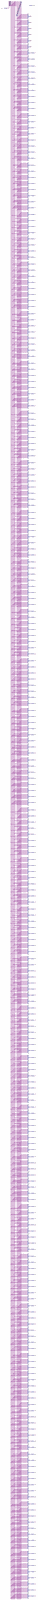
[diagram p0: schematic sheet, whole]
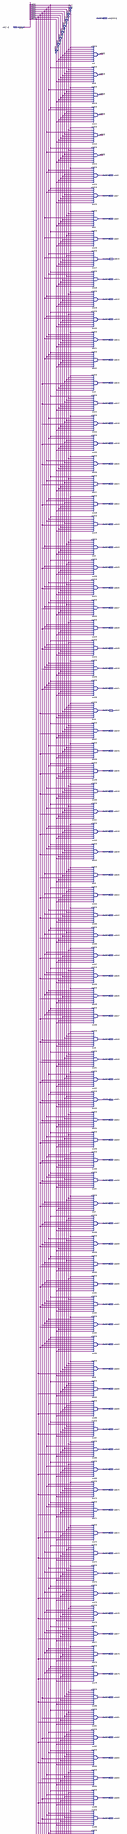
[diagram p1: schematic sheet, upper part]
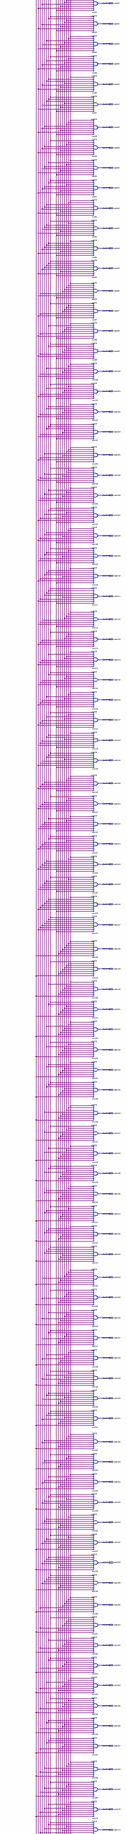
[diagram p2: schematic sheet, middle part]
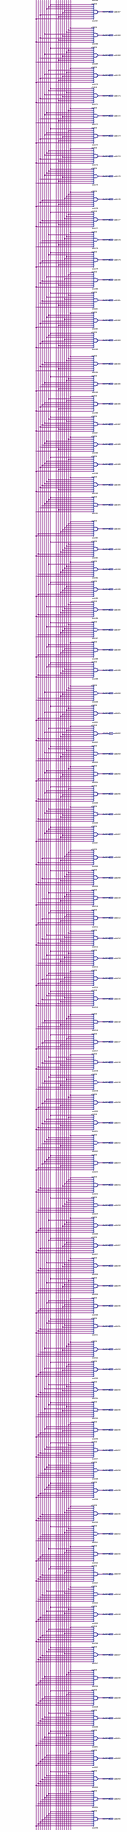
[diagram p3: schematic sheet, lower part]
// Quartus schematic ymq_8.bdf as structural Verilog: 264 symbols, 252 pins
module ymq_8 (
  input  [7:0] adr,
  output [255:0] addr,
  output addr6,
  output addr7,
  output addr8,
  output addr9,
  output addr10,
  output addr11,
  output addr12,
  output addr13,
  output addr14,
  output addr15,
  output addr16,
  output addr17,
  output addr18,
  output addr19,
  output addr20,
  output addr21,
  output addr22,
  output addr23,
  output addr24,
  output addr25,
  output addr26,
  output addr27,
  output addr28,
  output addr29,
  output addr30,
  output addr31,
  output addr32,
  output addr33,
  output addr34,
  output addr35,
  output addr36,
  output addr37,
  output addr38,
  output addr39,
  output addr40,
  output addr41,
  output addr42,
  output addr43,
  output addr44,
  output addr45,
  output addr46,
  output addr47,
  output addr48,
  output addr49,
  output addr50,
  output addr51,
  output addr52,
  output addr53,
  output addr54,
  output addr55,
  output addr56,
  output addr57,
  output addr58,
  output addr59,
  output addr60,
  output addr61,
  output addr62,
  output addr63,
  output addr64,
  output addr65,
  output addr66,
  output addr67,
  output addr68,
  output addr69,
  output addr70,
  output addr71,
  output addr72,
  output addr73,
  output addr74,
  output addr75,
  output addr76,
  output addr77,
  output addr78,
  output addr79,
  output addr80,
  output addr81,
  output addr82,
  output addr83,
  output addr84,
  output addr85,
  output addr86,
  output addr87,
  output addr88,
  output addr89,
  output addr90,
  output addr91,
  output addr92,
  output addr93,
  output addr94,
  output addr95,
  output addr96,
  output addr97,
  output addr98,
  output addr99,
  output addr100,
  output addr101,
  output addr102,
  output addr103,
  output addr104,
  output addr105,
  output addr106,
  output addr107,
  output addr108,
  output addr109,
  output addr110,
  output addr111,
  output addr112,
  output addr113,
  output addr114,
  output addr115,
  output addr116,
  output addr117,
  output addr118,
  output addr119,
  output addr120,
  output addr121,
  output addr122,
  output addr123,
  output addr124,
  output addr125,
  output addr126,
  output addr127,
  output addr128,
  output addr129,
  output addr130,
  output addr131,
  output addr132,
  output addr133,
  output addr134,
  output addr135,
  output addr136,
  output addr137,
  output addr138,
  output addr139,
  output addr140,
  output addr141,
  output addr142,
  output addr143,
  output addr144,
  output addr145,
  output addr146,
  output addr147,
  output addr148,
  output addr149,
  output addr150,
  output addr151,
  output addr152,
  output addr153,
  output addr154,
  output addr155,
  output addr156,
  output addr157,
  output addr158,
  output addr159,
  output addr160,
  output addr161,
  output addr162,
  output addr163,
  output addr164,
  output addr165,
  output addr166,
  output addr167,
  output addr168,
  output addr169,
  output addr170,
  output addr171,
  output addr172,
  output addr173,
  output addr174,
  output addr175,
  output addr176,
  output addr177,
  output addr178,
  output addr179,
  output addr180,
  output addr181,
  output addr182,
  output addr183,
  output addr184,
  output addr185,
  output addr186,
  output addr187,
  output addr188,
  output addr189,
  output addr190,
  output addr191,
  output addr192,
  output addr193,
  output addr194,
  output addr195,
  output addr196,
  output addr197,
  output addr198,
  output addr199,
  output addr200,
  output addr201,
  output addr202,
  output addr203,
  output addr204,
  output addr205,
  output addr206,
  output addr207,
  output addr208,
  output addr209,
  output addr210,
  output addr211,
  output addr212,
  output addr213,
  output addr214,
  output addr215,
  output addr216,
  output addr217,
  output addr218,
  output addr219,
  output addr220,
  output addr221,
  output addr222,
  output addr223,
  output addr224,
  output addr225,
  output addr226,
  output addr227,
  output addr228,
  output addr229,
  output addr230,
  output addr231,
  output addr232,
  output addr233,
  output addr234,
  output addr235,
  output addr236,
  output addr237,
  output addr238,
  output addr239,
  output addr240,
  output addr241,
  output addr242,
  output addr243,
  output addr244,
  output addr245,
  output addr246,
  output addr247,
  output addr248,
  output addr249,
  output addr250,
  output addr251,
  output addr252,
  output addr253,
  output addr254,
  output addr255
);

  wire inst1408_out, inst1409_out, inst1410_out, inst1411_out, inst1412_out, inst1413_out, inst1414_out,
       inst1415_out;

  not inst1410 (inst1410_out, adr[5]);
  not inst1409 (inst1409_out, adr[6]);
  not inst1408 (inst1408_out, adr[7]);
  not inst1414 (inst1414_out, adr[1]);
  not inst1413 (inst1413_out, adr[2]);
  not inst1412 (inst1412_out, adr[3]);
  not inst1411 (inst1411_out, adr[4]);
  not inst1415 (inst1415_out, adr[0]);
  and inst (addr[0], inst1415_out, inst1414_out, inst1413_out, inst1412_out, inst1411_out, inst1410_out, inst1409_out, inst1408_out);
  and inst9 (addr[1], adr[0], inst1414_out, inst1413_out, inst1412_out, inst1411_out, inst1410_out, inst1409_out, inst1408_out);
  and inst10 (addr[2], inst1415_out, adr[1], inst1413_out, inst1412_out, inst1411_out, inst1410_out, inst1409_out, inst1408_out);
  and inst11 (addr[3], adr[0], adr[1], inst1413_out, inst1412_out, inst1411_out, inst1410_out, inst1409_out, inst1408_out);
  and inst12 (addr[4], inst1415_out, inst1414_out, adr[2], inst1412_out, inst1411_out, inst1410_out, inst1409_out, inst1408_out);
  and inst13 (addr[5], adr[0], inst1414_out, adr[2], inst1412_out, inst1411_out, inst1410_out, inst1409_out, inst1408_out);
  and inst14 (addr[6], inst1415_out, adr[1], adr[2], inst1412_out, inst1411_out, inst1410_out, inst1409_out, inst1408_out);
  and inst15 (addr[7], adr[0], adr[1], adr[2], inst1412_out, inst1411_out, inst1410_out, inst1409_out, inst1408_out);
  and inst1 (addr[8], inst1415_out, inst1414_out, inst1413_out, adr[3], inst1411_out, inst1410_out, inst1409_out, inst1408_out);
  and inst16 (addr[9], adr[0], inst1414_out, inst1413_out, adr[3], inst1411_out, inst1410_out, inst1409_out, inst1408_out);
  and inst17 (addr[10], inst1415_out, adr[1], inst1413_out, adr[3], inst1411_out, inst1410_out, inst1409_out, inst1408_out);
  and inst18 (addr[11], adr[0], adr[1], inst1413_out, adr[3], inst1411_out, inst1410_out, inst1409_out, inst1408_out);
  and inst19 (addr[12], inst1415_out, inst1414_out, adr[2], adr[3], inst1411_out, inst1410_out, inst1409_out, inst1408_out);
  and inst20 (addr[13], adr[0], inst1414_out, adr[2], adr[3], inst1411_out, inst1410_out, inst1409_out, inst1408_out);
  and inst21 (addr[14], inst1415_out, adr[1], adr[2], adr[3], inst1411_out, inst1410_out, inst1409_out, inst1408_out);
  and inst22 (addr[15], adr[0], adr[1], adr[2], adr[3], inst1411_out, inst1410_out, inst1409_out, inst1408_out);
  and inst2 (addr[16], inst1415_out, inst1414_out, inst1413_out, inst1412_out, adr[4], inst1410_out, inst1409_out, inst1408_out);
  and inst23 (addr[17], adr[0], inst1414_out, inst1413_out, inst1412_out, adr[4], inst1410_out, inst1409_out, inst1408_out);
  and inst24 (addr[18], inst1415_out, adr[1], inst1413_out, inst1412_out, adr[4], inst1410_out, inst1409_out, inst1408_out);
  and inst25 (addr[19], adr[0], adr[1], inst1413_out, inst1412_out, adr[4], inst1410_out, inst1409_out, inst1408_out);
  and inst26 (addr[20], inst1415_out, inst1414_out, adr[2], inst1412_out, adr[4], inst1410_out, inst1409_out, inst1408_out);
  and inst27 (addr[21], adr[0], inst1414_out, adr[2], inst1412_out, adr[4], inst1410_out, inst1409_out, inst1408_out);
  and inst28 (addr[22], inst1415_out, adr[1], adr[2], inst1412_out, adr[4], inst1410_out, inst1409_out, inst1408_out);
  and inst29 (addr[23], adr[0], adr[1], adr[2], inst1412_out, adr[4], inst1410_out, inst1409_out, inst1408_out);
  and inst3 (addr[24], inst1415_out, inst1414_out, inst1413_out, adr[3], adr[4], inst1410_out, inst1409_out, inst1408_out);
  and inst30 (addr[25], adr[0], inst1414_out, inst1413_out, adr[3], adr[4], inst1410_out, inst1409_out, inst1408_out);
  and inst31 (addr[26], inst1415_out, adr[1], inst1413_out, adr[3], adr[4], inst1410_out, inst1409_out, inst1408_out);
  and inst32 (addr[27], adr[0], adr[1], inst1413_out, adr[3], adr[4], inst1410_out, inst1409_out, inst1408_out);
  and inst33 (addr[28], inst1415_out, inst1414_out, adr[2], adr[3], adr[4], inst1410_out, inst1409_out, inst1408_out);
  and inst34 (addr[29], adr[0], inst1414_out, adr[2], adr[3], adr[4], inst1410_out, inst1409_out, inst1408_out);
  and inst35 (addr[30], inst1415_out, adr[1], adr[2], adr[3], adr[4], inst1410_out, inst1409_out, inst1408_out);
  and inst36 (addr[31], adr[0], adr[1], adr[2], adr[3], adr[4], inst1410_out, inst1409_out, inst1408_out);
  and inst4 (addr[32], inst1415_out, inst1414_out, inst1413_out, inst1412_out, inst1411_out, adr[5], inst1409_out, inst1408_out);
  and inst37 (addr[33], adr[0], inst1414_out, inst1413_out, inst1412_out, inst1411_out, adr[5], inst1409_out, inst1408_out);
  and inst38 (addr[34], inst1415_out, adr[1], inst1413_out, inst1412_out, inst1411_out, adr[5], inst1409_out, inst1408_out);
  and inst39 (addr[35], adr[0], adr[1], inst1413_out, inst1412_out, inst1411_out, adr[5], inst1409_out, inst1408_out);
  and inst40 (addr[36], inst1415_out, inst1414_out, adr[2], inst1412_out, inst1411_out, adr[5], inst1409_out, inst1408_out);
  and inst41 (addr[37], adr[0], inst1414_out, adr[2], inst1412_out, inst1411_out, adr[5], inst1409_out, inst1408_out);
  and inst42 (addr[38], inst1415_out, adr[1], adr[2], inst1412_out, inst1411_out, adr[5], inst1409_out, inst1408_out);
  and inst43 (addr[39], adr[0], adr[1], adr[2], inst1412_out, inst1411_out, adr[5], inst1409_out, inst1408_out);
  and inst5 (addr[40], inst1415_out, inst1414_out, inst1413_out, adr[3], inst1411_out, adr[5], inst1409_out, inst1408_out);
  and inst44 (addr[41], adr[0], inst1414_out, inst1413_out, adr[3], inst1411_out, adr[5], inst1409_out, inst1408_out);
  and inst45 (addr[42], inst1415_out, adr[1], inst1413_out, adr[3], inst1411_out, adr[5], inst1409_out, inst1408_out);
  and inst46 (addr[43], adr[0], adr[1], inst1413_out, adr[3], inst1411_out, adr[5], inst1409_out, inst1408_out);
  and inst47 (addr[44], inst1415_out, inst1414_out, adr[2], adr[3], inst1411_out, adr[5], inst1409_out, inst1408_out);
  and inst48 (addr[45], adr[0], inst1414_out, adr[2], adr[3], inst1411_out, adr[5], inst1409_out, inst1408_out);
  and inst49 (addr[46], inst1415_out, adr[1], adr[2], adr[3], inst1411_out, adr[5], inst1409_out, inst1408_out);
  and inst50 (addr[47], adr[0], adr[1], adr[2], adr[3], inst1411_out, adr[5], inst1409_out, inst1408_out);
  and inst6 (addr[48], inst1415_out, inst1414_out, inst1413_out, inst1412_out, adr[4], adr[5], inst1409_out, inst1408_out);
  and inst51 (addr[49], adr[0], inst1414_out, inst1413_out, inst1412_out, adr[4], adr[5], inst1409_out, inst1408_out);
  and inst52 (addr[50], inst1415_out, adr[1], inst1413_out, inst1412_out, adr[4], adr[5], inst1409_out, inst1408_out);
  and inst53 (addr[51], adr[0], adr[1], inst1413_out, inst1412_out, adr[4], adr[5], inst1409_out, inst1408_out);
  and inst54 (addr[52], inst1415_out, inst1414_out, adr[2], inst1412_out, adr[4], adr[5], inst1409_out, inst1408_out);
  and inst55 (addr[53], adr[0], inst1414_out, adr[2], inst1412_out, adr[4], adr[5], inst1409_out, inst1408_out);
  and inst56 (addr[54], inst1415_out, adr[1], adr[2], inst1412_out, adr[4], adr[5], inst1409_out, inst1408_out);
  and inst57 (addr[55], adr[0], adr[1], adr[2], inst1412_out, adr[4], adr[5], inst1409_out, inst1408_out);
  and inst7 (addr[56], inst1415_out, inst1414_out, inst1413_out, adr[3], adr[4], adr[5], inst1409_out, inst1408_out);
  and inst58 (addr[57], adr[0], inst1414_out, inst1413_out, adr[3], adr[4], adr[5], inst1409_out, inst1408_out);
  and inst59 (addr[58], inst1415_out, adr[1], inst1413_out, adr[3], adr[4], adr[5], inst1409_out, inst1408_out);
  and inst60 (addr[59], adr[0], adr[1], inst1413_out, adr[3], adr[4], adr[5], inst1409_out, inst1408_out);
  and inst61 (addr[60], inst1415_out, inst1414_out, adr[2], adr[3], adr[4], adr[5], inst1409_out, inst1408_out);
  and inst62 (addr[61], adr[0], inst1414_out, adr[2], adr[3], adr[4], adr[5], inst1409_out, inst1408_out);
  and inst63 (addr[62], inst1415_out, adr[1], adr[2], adr[3], adr[4], adr[5], inst1409_out, inst1408_out);
  and inst64 (addr[63], adr[0], adr[1], adr[2], adr[3], adr[4], adr[5], inst1409_out, inst1408_out);
  and inst8 (addr[64], inst1415_out, inst1414_out, inst1413_out, inst1412_out, inst1411_out, inst1410_out, adr[6], inst1408_out);
  and inst65 (addr[65], adr[0], inst1414_out, inst1413_out, inst1412_out, inst1411_out, inst1410_out, adr[6], inst1408_out);
  and inst66 (addr[66], inst1415_out, adr[1], inst1413_out, inst1412_out, inst1411_out, inst1410_out, adr[6], inst1408_out);
  and inst67 (addr[67], adr[0], adr[1], inst1413_out, inst1412_out, inst1411_out, inst1410_out, adr[6], inst1408_out);
  and inst68 (addr[68], inst1415_out, inst1414_out, adr[2], inst1412_out, inst1411_out, inst1410_out, adr[6], inst1408_out);
  and inst69 (addr[69], adr[0], inst1414_out, adr[2], inst1412_out, inst1411_out, inst1410_out, adr[6], inst1408_out);
  and inst70 (addr[70], inst1415_out, adr[1], adr[2], inst1412_out, inst1411_out, inst1410_out, adr[6], inst1408_out);
  and inst71 (addr[71], adr[0], adr[1], adr[2], inst1412_out, inst1411_out, inst1410_out, adr[6], inst1408_out);
  and inst72 (addr[72], inst1415_out, inst1414_out, inst1413_out, adr[3], inst1411_out, inst1410_out, adr[6], inst1408_out);
  and inst73 (addr[73], adr[0], inst1414_out, inst1413_out, adr[3], inst1411_out, inst1410_out, adr[6], inst1408_out);
  and inst74 (addr[74], inst1415_out, adr[1], inst1413_out, adr[3], inst1411_out, inst1410_out, adr[6], inst1408_out);
  and inst75 (addr[75], adr[0], adr[1], inst1413_out, adr[3], inst1411_out, inst1410_out, adr[6], inst1408_out);
  and inst76 (addr[76], inst1415_out, inst1414_out, adr[2], adr[3], inst1411_out, inst1410_out, adr[6], inst1408_out);
  and inst77 (addr[77], adr[0], inst1414_out, adr[2], adr[3], inst1411_out, inst1410_out, adr[6], inst1408_out);
  and inst78 (addr[78], inst1415_out, adr[1], adr[2], adr[3], inst1411_out, inst1410_out, adr[6], inst1408_out);
  and inst79 (addr[79], adr[0], adr[1], adr[2], adr[3], inst1411_out, inst1410_out, adr[6], inst1408_out);
  and inst80 (addr[80], inst1415_out, inst1414_out, inst1413_out, inst1412_out, adr[4], inst1410_out, adr[6], inst1408_out);
  and inst81 (addr[81], adr[0], inst1414_out, inst1413_out, inst1412_out, adr[4], inst1410_out, adr[6], inst1408_out);
  and inst82 (addr[82], inst1415_out, adr[1], inst1413_out, inst1412_out, adr[4], inst1410_out, adr[6], inst1408_out);
  and inst83 (addr[83], adr[0], adr[1], inst1413_out, inst1412_out, adr[4], inst1410_out, adr[6], inst1408_out);
  and inst84 (addr[84], inst1415_out, inst1414_out, adr[2], inst1412_out, adr[4], inst1410_out, adr[6], inst1408_out);
  and inst85 (addr[85], adr[0], inst1414_out, adr[2], inst1412_out, adr[4], inst1410_out, adr[6], inst1408_out);
  and inst86 (addr[86], inst1415_out, adr[1], adr[2], inst1412_out, adr[4], inst1410_out, adr[6], inst1408_out);
  and inst87 (addr[87], adr[0], adr[1], adr[2], inst1412_out, adr[4], inst1410_out, adr[6], inst1408_out);
  and inst88 (addr[88], inst1415_out, inst1414_out, inst1413_out, adr[3], adr[4], inst1410_out, adr[6], inst1408_out);
  and inst89 (addr[89], adr[0], inst1414_out, inst1413_out, adr[3], adr[4], inst1410_out, adr[6], inst1408_out);
  and inst90 (addr[90], inst1415_out, adr[1], inst1413_out, adr[3], adr[4], inst1410_out, adr[6], inst1408_out);
  and inst91 (addr[91], adr[0], adr[1], inst1413_out, adr[3], adr[4], inst1410_out, adr[6], inst1408_out);
  and inst92 (addr[92], inst1415_out, inst1414_out, adr[2], adr[3], adr[4], inst1410_out, adr[6], inst1408_out);
  and inst93 (addr[93], adr[0], inst1414_out, adr[2], adr[3], adr[4], inst1410_out, adr[6], inst1408_out);
  and inst94 (addr[94], inst1415_out, adr[1], adr[2], adr[3], adr[4], inst1410_out, adr[6], inst1408_out);
  and inst95 (addr[95], adr[0], adr[1], adr[2], adr[3], adr[4], inst1410_out, adr[6], inst1408_out);
  and inst96 (addr[96], inst1415_out, inst1414_out, inst1413_out, inst1412_out, inst1411_out, adr[5], adr[6], inst1408_out);
  and inst97 (addr[97], adr[0], inst1414_out, inst1413_out, inst1412_out, inst1411_out, adr[5], adr[6], inst1408_out);
  and inst98 (addr[98], inst1415_out, adr[1], inst1413_out, inst1412_out, inst1411_out, adr[5], adr[6], inst1408_out);
  and inst99 (addr[99], adr[0], adr[1], inst1413_out, inst1412_out, inst1411_out, adr[5], adr[6], inst1408_out);
  and inst100 (addr[100], inst1415_out, inst1414_out, adr[2], inst1412_out, inst1411_out, adr[5], adr[6], inst1408_out);
  and inst101 (addr[101], adr[0], inst1414_out, adr[2], inst1412_out, inst1411_out, adr[5], adr[6], inst1408_out);
  and inst102 (addr[102], inst1415_out, adr[1], adr[2], inst1412_out, inst1411_out, adr[5], adr[6], inst1408_out);
  and inst103 (addr[103], adr[0], adr[1], adr[2], inst1412_out, inst1411_out, adr[5], adr[6], inst1408_out);
  and inst104 (addr[104], inst1415_out, inst1414_out, inst1413_out, adr[3], inst1411_out, adr[5], adr[6], inst1408_out);
  and inst105 (addr[105], adr[0], inst1414_out, inst1413_out, adr[3], inst1411_out, adr[5], adr[6], inst1408_out);
  and inst106 (addr[106], inst1415_out, adr[1], inst1413_out, adr[3], inst1411_out, adr[5], adr[6], inst1408_out);
  and inst107 (addr[107], adr[0], adr[1], inst1413_out, adr[3], inst1411_out, adr[5], adr[6], inst1408_out);
  and inst108 (addr[108], inst1415_out, inst1414_out, adr[2], adr[3], inst1411_out, adr[5], adr[6], inst1408_out);
  and inst109 (addr[109], adr[0], inst1414_out, adr[2], adr[3], inst1411_out, adr[5], adr[6], inst1408_out);
  and inst110 (addr[110], inst1415_out, adr[1], adr[2], adr[3], inst1411_out, adr[5], adr[6], inst1408_out);
  and inst111 (addr[111], adr[0], adr[1], adr[2], adr[3], inst1411_out, adr[5], adr[6], inst1408_out);
  and inst112 (addr[112], inst1415_out, inst1414_out, inst1413_out, inst1412_out, adr[4], adr[5], adr[6], inst1408_out);
  and inst113 (addr[113], adr[0], inst1414_out, inst1413_out, inst1412_out, adr[4], adr[5], adr[6], inst1408_out);
  and inst114 (addr[114], inst1415_out, adr[1], inst1413_out, inst1412_out, adr[4], adr[5], adr[6], inst1408_out);
  and inst115 (addr[115], adr[0], adr[1], inst1413_out, inst1412_out, adr[4], adr[5], adr[6], inst1408_out);
  and inst116 (addr[116], inst1415_out, inst1414_out, adr[2], inst1412_out, adr[4], adr[5], adr[6], inst1408_out);
  and inst117 (addr[117], adr[0], inst1414_out, adr[2], inst1412_out, adr[4], adr[5], adr[6], inst1408_out);
  and inst118 (addr[118], inst1415_out, adr[1], adr[2], inst1412_out, adr[4], adr[5], adr[6], inst1408_out);
  and inst119 (addr[119], adr[0], adr[1], adr[2], inst1412_out, adr[4], adr[5], adr[6], inst1408_out);
  and inst120 (addr[120], inst1415_out, inst1414_out, inst1413_out, adr[3], adr[4], adr[5], adr[6], inst1408_out);
  and inst121 (addr[121], adr[0], inst1414_out, inst1413_out, adr[3], adr[4], adr[5], adr[6], inst1408_out);
  and inst122 (addr[122], inst1415_out, adr[1], inst1413_out, adr[3], adr[4], adr[5], adr[6], inst1408_out);
  and inst123 (addr[123], adr[0], adr[1], inst1413_out, adr[3], adr[4], adr[5], adr[6], inst1408_out);
  and inst124 (addr[124], inst1415_out, inst1414_out, adr[2], adr[3], adr[4], adr[5], adr[6], inst1408_out);
  and inst125 (addr[125], adr[0], inst1414_out, adr[2], adr[3], adr[4], adr[5], adr[6], inst1408_out);
  and inst126 (addr[126], inst1415_out, adr[1], adr[2], adr[3], adr[4], adr[5], adr[6], inst1408_out);
  and inst127 (addr[127], adr[0], adr[1], adr[2], adr[3], adr[4], adr[5], adr[6], inst1408_out);
  and inst128 (addr[128], inst1415_out, inst1414_out, inst1413_out, inst1412_out, inst1411_out, inst1410_out, inst1409_out, adr[7]);
  and inst129 (addr[129], adr[0], inst1414_out, inst1413_out, inst1412_out, inst1411_out, inst1410_out, inst1409_out, adr[7]);
  and inst130 (addr[130], inst1415_out, adr[1], inst1413_out, inst1412_out, inst1411_out, inst1410_out, inst1409_out, adr[7]);
  and inst131 (addr[131], adr[0], adr[1], inst1413_out, inst1412_out, inst1411_out, inst1410_out, inst1409_out, adr[7]);
  and inst132 (addr[132], inst1415_out, inst1414_out, adr[2], inst1412_out, inst1411_out, inst1410_out, inst1409_out, adr[7]);
  and inst133 (addr[133], adr[0], inst1414_out, adr[2], inst1412_out, inst1411_out, inst1410_out, inst1409_out, adr[7]);
  and inst134 (addr[134], inst1415_out, adr[1], adr[2], inst1412_out, inst1411_out, inst1410_out, inst1409_out, adr[7]);
  and inst135 (addr[135], adr[0], adr[1], adr[2], inst1412_out, inst1411_out, inst1410_out, inst1409_out, adr[7]);
  and inst136 (addr[136], inst1415_out, inst1414_out, inst1413_out, adr[3], inst1411_out, inst1410_out, inst1409_out, adr[7]);
  and inst137 (addr[137], adr[0], inst1414_out, inst1413_out, adr[3], inst1411_out, inst1410_out, inst1409_out, adr[7]);
  and inst138 (addr[138], inst1415_out, adr[1], inst1413_out, adr[3], inst1411_out, inst1410_out, inst1409_out, adr[7]);
  and inst139 (addr[139], adr[0], adr[1], inst1413_out, adr[3], inst1411_out, inst1410_out, inst1409_out, adr[7]);
  and inst140 (addr[140], inst1415_out, inst1414_out, adr[2], adr[3], inst1411_out, inst1410_out, inst1409_out, adr[7]);
  and inst141 (addr[141], adr[0], inst1414_out, adr[2], adr[3], inst1411_out, inst1410_out, inst1409_out, adr[7]);
  and inst142 (addr[142], inst1415_out, adr[1], adr[2], adr[3], inst1411_out, inst1410_out, inst1409_out, adr[7]);
  and inst143 (addr[143], adr[0], adr[1], adr[2], adr[3], inst1411_out, inst1410_out, inst1409_out, adr[7]);
  and inst144 (addr[144], inst1415_out, inst1414_out, inst1413_out, inst1412_out, adr[4], inst1410_out, inst1409_out, adr[7]);
  and inst145 (addr[145], adr[0], inst1414_out, inst1413_out, inst1412_out, adr[4], inst1410_out, inst1409_out, adr[7]);
  and inst146 (addr[146], inst1415_out, adr[1], inst1413_out, inst1412_out, adr[4], inst1410_out, inst1409_out, adr[7]);
  and inst147 (addr[147], adr[0], adr[1], inst1413_out, inst1412_out, adr[4], inst1410_out, inst1409_out, adr[7]);
  and inst148 (addr[148], inst1415_out, inst1414_out, adr[2], inst1412_out, adr[4], inst1410_out, inst1409_out, adr[7]);
  and inst149 (addr[149], adr[0], inst1414_out, adr[2], inst1412_out, adr[4], inst1410_out, inst1409_out, adr[7]);
  and inst150 (addr[150], inst1415_out, adr[1], adr[2], inst1412_out, adr[4], inst1410_out, inst1409_out, adr[7]);
  and inst151 (addr[151], adr[0], adr[1], adr[2], inst1412_out, adr[4], inst1410_out, inst1409_out, adr[7]);
  and inst152 (addr[152], inst1415_out, inst1414_out, inst1413_out, adr[3], adr[4], inst1410_out, inst1409_out, adr[7]);
  and inst153 (addr[153], adr[0], inst1414_out, inst1413_out, adr[3], adr[4], inst1410_out, inst1409_out, adr[7]);
  and inst154 (addr[154], inst1415_out, adr[1], inst1413_out, adr[3], adr[4], inst1410_out, inst1409_out, adr[7]);
  and inst155 (addr[155], adr[0], adr[1], inst1413_out, adr[3], adr[4], inst1410_out, inst1409_out, adr[7]);
  and inst156 (addr[156], inst1415_out, inst1414_out, adr[2], adr[3], adr[4], inst1410_out, inst1409_out, adr[7]);
  and inst157 (addr[157], adr[0], inst1414_out, adr[2], adr[3], adr[4], inst1410_out, inst1409_out, adr[7]);
  and inst158 (addr[158], inst1415_out, adr[1], adr[2], adr[3], adr[4], inst1410_out, inst1409_out, adr[7]);
  and inst159 (addr[159], adr[0], adr[1], adr[2], adr[3], adr[4], inst1410_out, inst1409_out, adr[7]);
  and inst160 (addr[160], inst1415_out, inst1414_out, inst1413_out, inst1412_out, inst1411_out, adr[5], inst1409_out, adr[7]);
  and inst161 (addr[161], adr[0], inst1414_out, inst1413_out, inst1412_out, inst1411_out, adr[5], inst1409_out, adr[7]);
  and inst162 (addr[162], inst1415_out, adr[1], inst1413_out, inst1412_out, inst1411_out, adr[5], inst1409_out, adr[7]);
  and inst163 (addr[163], adr[0], adr[1], inst1413_out, inst1412_out, inst1411_out, adr[5], inst1409_out, adr[7]);
  and inst164 (addr[164], inst1415_out, inst1414_out, adr[2], inst1412_out, inst1411_out, adr[5], inst1409_out, adr[7]);
  and inst165 (addr[165], adr[0], inst1414_out, adr[2], inst1412_out, inst1411_out, adr[5], inst1409_out, adr[7]);
  and inst166 (addr[166], inst1415_out, adr[1], adr[2], inst1412_out, inst1411_out, adr[5], inst1409_out, adr[7]);
  and inst167 (addr[167], adr[0], adr[1], adr[2], inst1412_out, inst1411_out, adr[5], inst1409_out, adr[7]);
  and inst168 (addr[168], inst1415_out, inst1414_out, inst1413_out, adr[3], inst1411_out, adr[5], inst1409_out, adr[7]);
  and inst169 (addr[169], adr[0], inst1414_out, inst1413_out, adr[3], inst1411_out, adr[5], inst1409_out, adr[7]);
  and inst170 (addr[170], inst1415_out, adr[1], inst1413_out, adr[3], inst1411_out, adr[5], inst1409_out, adr[7]);
  and inst171 (addr[171], adr[0], adr[1], inst1413_out, adr[3], inst1411_out, adr[5], inst1409_out, adr[7]);
  and inst172 (addr[172], inst1415_out, inst1414_out, adr[2], adr[3], inst1411_out, adr[5], inst1409_out, adr[7]);
  and inst173 (addr[173], adr[0], inst1414_out, adr[2], adr[3], inst1411_out, adr[5], inst1409_out, adr[7]);
  and inst174 (addr[174], inst1415_out, adr[1], adr[2], adr[3], inst1411_out, adr[5], inst1409_out, adr[7]);
  and inst175 (addr[175], adr[0], adr[1], adr[2], adr[3], inst1411_out, adr[5], inst1409_out, adr[7]);
  and inst176 (addr[176], inst1415_out, inst1414_out, inst1413_out, inst1412_out, adr[4], adr[5], inst1409_out, adr[7]);
  and inst177 (addr[177], adr[0], inst1414_out, inst1413_out, inst1412_out, adr[4], adr[5], inst1409_out, adr[7]);
  and inst178 (addr[178], inst1415_out, adr[1], inst1413_out, inst1412_out, adr[4], adr[5], inst1409_out, adr[7]);
  and inst179 (addr[179], adr[0], adr[1], inst1413_out, inst1412_out, adr[4], adr[5], inst1409_out, adr[7]);
  and inst180 (addr[180], inst1415_out, inst1414_out, adr[2], inst1412_out, adr[4], adr[5], inst1409_out, adr[7]);
  and inst181 (addr[181], adr[0], inst1414_out, adr[2], inst1412_out, adr[4], adr[5], inst1409_out, adr[7]);
  and inst182 (addr[182], inst1415_out, adr[1], adr[2], inst1412_out, adr[4], adr[5], inst1409_out, adr[7]);
  and inst183 (addr[183], adr[0], adr[1], adr[2], inst1412_out, adr[4], adr[5], inst1409_out, adr[7]);
  and inst184 (addr[184], inst1415_out, inst1414_out, inst1413_out, adr[3], adr[4], adr[5], inst1409_out, adr[7]);
  and inst185 (addr[185], adr[0], inst1414_out, inst1413_out, adr[3], adr[4], adr[5], inst1409_out, adr[7]);
  and inst186 (addr[186], inst1415_out, adr[1], inst1413_out, adr[3], adr[4], adr[5], inst1409_out, adr[7]);
  and inst187 (addr[187], adr[0], adr[1], inst1413_out, adr[3], adr[4], adr[5], inst1409_out, adr[7]);
  and inst188 (addr[188], inst1415_out, inst1414_out, adr[2], adr[3], adr[4], adr[5], inst1409_out, adr[7]);
  and inst189 (addr[189], adr[0], inst1414_out, adr[2], adr[3], adr[4], adr[5], inst1409_out, adr[7]);
  and inst190 (addr[190], inst1415_out, adr[1], adr[2], adr[3], adr[4], adr[5], inst1409_out, adr[7]);
  and inst191 (addr[191], adr[0], adr[1], adr[2], adr[3], adr[4], adr[5], inst1409_out, adr[7]);
  and inst192 (addr[192], inst1415_out, inst1414_out, inst1413_out, inst1412_out, inst1411_out, inst1410_out, adr[6], adr[7]);
  and inst193 (addr[193], adr[0], inst1414_out, inst1413_out, inst1412_out, inst1411_out, inst1410_out, adr[6], adr[7]);
  and inst194 (addr[194], inst1415_out, adr[1], inst1413_out, inst1412_out, inst1411_out, inst1410_out, adr[6], adr[7]);
  and inst195 (addr[195], adr[0], adr[1], inst1413_out, inst1412_out, inst1411_out, inst1410_out, adr[6], adr[7]);
  and inst196 (addr[196], inst1415_out, inst1414_out, adr[2], inst1412_out, inst1411_out, inst1410_out, adr[6], adr[7]);
  and inst197 (addr[197], adr[0], inst1414_out, adr[2], inst1412_out, inst1411_out, inst1410_out, adr[6], adr[7]);
  and inst198 (addr[198], inst1415_out, adr[1], adr[2], inst1412_out, inst1411_out, inst1410_out, adr[6], adr[7]);
  and inst199 (addr[199], adr[0], adr[1], adr[2], inst1412_out, inst1411_out, inst1410_out, adr[6], adr[7]);
  and inst200 (addr[200], inst1415_out, inst1414_out, inst1413_out, adr[3], inst1411_out, inst1410_out, adr[6], adr[7]);
  and inst201 (addr[201], adr[0], inst1414_out, inst1413_out, adr[3], inst1411_out, inst1410_out, adr[6], adr[7]);
  and inst202 (addr[202], inst1415_out, adr[1], inst1413_out, adr[3], inst1411_out, inst1410_out, adr[6], adr[7]);
  and inst203 (addr[203], adr[0], adr[1], inst1413_out, adr[3], inst1411_out, inst1410_out, adr[6], adr[7]);
  and inst204 (addr[204], inst1415_out, inst1414_out, adr[2], adr[3], inst1411_out, inst1410_out, adr[6], adr[7]);
  and inst205 (addr[205], adr[0], inst1414_out, adr[2], adr[3], inst1411_out, inst1410_out, adr[6], adr[7]);
  and inst206 (addr[206], inst1415_out, adr[1], adr[2], adr[3], inst1411_out, inst1410_out, adr[6], adr[7]);
  and inst207 (addr[207], adr[0], adr[1], adr[2], adr[3], inst1411_out, inst1410_out, adr[6], adr[7]);
  and inst208 (addr[208], inst1415_out, inst1414_out, inst1413_out, inst1412_out, adr[4], inst1410_out, adr[6], adr[7]);
  and inst209 (addr[209], adr[0], inst1414_out, inst1413_out, inst1412_out, adr[4], inst1410_out, adr[6], adr[7]);
  and inst210 (addr[210], inst1415_out, adr[1], inst1413_out, inst1412_out, adr[4], inst1410_out, adr[6], adr[7]);
  and inst211 (addr[211], adr[0], adr[1], inst1413_out, inst1412_out, adr[4], inst1410_out, adr[6], adr[7]);
  and inst212 (addr[212], inst1415_out, inst1414_out, adr[2], inst1412_out, adr[4], inst1410_out, adr[6], adr[7]);
  and inst213 (addr[213], adr[0], inst1414_out, adr[2], inst1412_out, adr[4], inst1410_out, adr[6], adr[7]);
  and inst214 (addr[214], inst1415_out, adr[1], adr[2], inst1412_out, adr[4], inst1410_out, adr[6], adr[7]);
  and inst215 (addr[215], adr[0], adr[1], adr[2], inst1412_out, adr[4], inst1410_out, adr[6], adr[7]);
  and inst216 (addr[216], inst1415_out, inst1414_out, inst1413_out, adr[3], adr[4], inst1410_out, adr[6], adr[7]);
  and inst217 (addr[217], adr[0], inst1414_out, inst1413_out, adr[3], adr[4], inst1410_out, adr[6], adr[7]);
  and inst218 (addr[218], inst1415_out, adr[1], inst1413_out, adr[3], adr[4], inst1410_out, adr[6], adr[7]);
  and inst219 (addr[219], adr[0], adr[1], inst1413_out, adr[3], adr[4], inst1410_out, adr[6], adr[7]);
  and inst220 (addr[220], inst1415_out, inst1414_out, adr[2], adr[3], adr[4], inst1410_out, adr[6], adr[7]);
  and inst221 (addr[221], adr[0], inst1414_out, adr[2], adr[3], adr[4], inst1410_out, adr[6], adr[7]);
  and inst222 (addr[222], inst1415_out, adr[1], adr[2], adr[3], adr[4], inst1410_out, adr[6], adr[7]);
  and inst223 (addr[223], adr[0], adr[1], adr[2], adr[3], adr[4], inst1410_out, adr[6], adr[7]);
  and inst224 (addr[224], inst1415_out, inst1414_out, inst1413_out, inst1412_out, inst1411_out, adr[5], adr[6], adr[7]);
  and inst225 (addr[225], adr[0], inst1414_out, inst1413_out, inst1412_out, inst1411_out, adr[5], adr[6], adr[7]);
  and inst226 (addr[226], inst1415_out, adr[1], inst1413_out, inst1412_out, inst1411_out, adr[5], adr[6], adr[7]);
  and inst227 (addr[227], adr[0], adr[1], inst1413_out, inst1412_out, inst1411_out, adr[5], adr[6], adr[7]);
  and inst228 (addr[228], inst1415_out, inst1414_out, adr[2], inst1412_out, inst1411_out, adr[5], adr[6], adr[7]);
  and inst229 (addr[229], adr[0], inst1414_out, adr[2], inst1412_out, inst1411_out, adr[5], adr[6], adr[7]);
  and inst230 (addr[230], inst1415_out, adr[1], adr[2], inst1412_out, inst1411_out, adr[5], adr[6], adr[7]);
  and inst231 (addr[231], adr[0], adr[1], adr[2], inst1412_out, inst1411_out, adr[5], adr[6], adr[7]);
  and inst232 (addr[232], inst1415_out, inst1414_out, inst1413_out, adr[3], inst1411_out, adr[5], adr[6], adr[7]);
  and inst233 (addr[233], adr[0], inst1414_out, inst1413_out, adr[3], inst1411_out, adr[5], adr[6], adr[7]);
  and inst234 (addr[234], inst1415_out, adr[1], inst1413_out, adr[3], inst1411_out, adr[5], adr[6], adr[7]);
  and inst235 (addr[235], adr[0], adr[1], inst1413_out, adr[3], inst1411_out, adr[5], adr[6], adr[7]);
  and inst236 (addr[236], inst1415_out, inst1414_out, adr[2], adr[3], inst1411_out, adr[5], adr[6], adr[7]);
  and inst237 (addr[237], adr[0], inst1414_out, adr[2], adr[3], inst1411_out, adr[5], adr[6], adr[7]);
  and inst238 (addr[238], inst1415_out, adr[1], adr[2], adr[3], inst1411_out, adr[5], adr[6], adr[7]);
  and inst239 (addr[239], adr[0], adr[1], adr[2], adr[3], inst1411_out, adr[5], adr[6], adr[7]);
  and inst240 (addr[240], inst1415_out, inst1414_out, inst1413_out, inst1412_out, adr[4], adr[5], adr[6], adr[7]);
  and inst241 (addr[241], adr[0], inst1414_out, inst1413_out, inst1412_out, adr[4], adr[5], adr[6], adr[7]);
  and inst242 (addr[242], inst1415_out, adr[1], inst1413_out, inst1412_out, adr[4], adr[5], adr[6], adr[7]);
  and inst243 (addr[243], adr[0], adr[1], inst1413_out, inst1412_out, adr[4], adr[5], adr[6], adr[7]);
  and inst244 (addr[244], inst1415_out, inst1414_out, adr[2], inst1412_out, adr[4], adr[5], adr[6], adr[7]);
  and inst245 (addr[245], adr[0], inst1414_out, adr[2], inst1412_out, adr[4], adr[5], adr[6], adr[7]);
  and inst246 (addr[246], inst1415_out, adr[1], adr[2], inst1412_out, adr[4], adr[5], adr[6], adr[7]);
  and inst247 (addr[247], adr[0], adr[1], adr[2], inst1412_out, adr[4], adr[5], adr[6], adr[7]);
  and inst248 (addr[248], inst1415_out, inst1414_out, inst1413_out, adr[3], adr[4], adr[5], adr[6], adr[7]);
  and inst249 (addr[249], adr[0], inst1414_out, inst1413_out, adr[3], adr[4], adr[5], adr[6], adr[7]);
  and inst250 (addr[250], inst1415_out, adr[1], inst1413_out, adr[3], adr[4], adr[5], adr[6], adr[7]);
  and inst251 (addr[251], adr[0], adr[1], inst1413_out, adr[3], adr[4], adr[5], adr[6], adr[7]);
  and inst252 (addr[252], inst1415_out, inst1414_out, adr[2], adr[3], adr[4], adr[5], adr[6], adr[7]);
  and inst253 (addr[253], adr[0], inst1414_out, adr[2], adr[3], adr[4], adr[5], adr[6], adr[7]);
  and inst254 (addr[254], inst1415_out, adr[1], adr[2], adr[3], adr[4], adr[5], adr[6], adr[7]);
  and inst255 (addr[255], adr[0], adr[1], adr[2], adr[3], adr[4], adr[5], adr[6], adr[7]);

  assign addr6 = addr[6];
  assign addr7 = addr[7];
  assign addr8 = addr[8];
  assign addr9 = addr[9];
  assign addr10 = addr[10];
  assign addr11 = addr[11];
  assign addr12 = addr[12];
  assign addr13 = addr[13];
  assign addr14 = addr[14];
  assign addr15 = addr[15];
  assign addr16 = addr[16];
  assign addr17 = addr[17];
  assign addr18 = addr[18];
  assign addr19 = addr[19];
  assign addr20 = addr[20];
  assign addr21 = addr[21];
  assign addr22 = addr[22];
  assign addr23 = addr[23];
  assign addr24 = addr[24];
  assign addr25 = addr[25];
  assign addr26 = addr[26];
  assign addr27 = addr[27];
  assign addr28 = addr[28];
  assign addr29 = addr[29];
  assign addr30 = addr[30];
  assign addr31 = addr[31];
  assign addr32 = addr[32];
  assign addr33 = addr[33];
  assign addr34 = addr[34];
  assign addr35 = addr[35];
  assign addr36 = addr[36];
  assign addr37 = addr[37];
  assign addr38 = addr[38];
  assign addr39 = addr[39];
  assign addr40 = addr[40];
  assign addr41 = addr[41];
  assign addr42 = addr[42];
  assign addr43 = addr[43];
  assign addr44 = addr[44];
  assign addr45 = addr[45];
  assign addr46 = addr[46];
  assign addr47 = addr[47];
  assign addr48 = addr[48];
  assign addr49 = addr[49];
  assign addr50 = addr[50];
  assign addr51 = addr[51];
  assign addr52 = addr[52];
  assign addr53 = addr[53];
  assign addr54 = addr[54];
  assign addr55 = addr[55];
  assign addr56 = addr[56];
  assign addr57 = addr[57];
  assign addr58 = addr[58];
  assign addr59 = addr[59];
  assign addr60 = addr[60];
  assign addr61 = addr[61];
  assign addr62 = addr[62];
  assign addr63 = addr[63];
  assign addr64 = addr[64];
  assign addr65 = addr[65];
  assign addr66 = addr[66];
  assign addr67 = addr[67];
  assign addr68 = addr[68];
  assign addr69 = addr[69];
  assign addr70 = addr[70];
  assign addr71 = addr[71];
  assign addr72 = addr[72];
  assign addr73 = addr[73];
  assign addr74 = addr[74];
  assign addr75 = addr[75];
  assign addr76 = addr[76];
  assign addr77 = addr[77];
  assign addr78 = addr[78];
  assign addr79 = addr[79];
  assign addr80 = addr[80];
  assign addr81 = addr[81];
  assign addr82 = addr[82];
  assign addr83 = addr[83];
  assign addr84 = addr[84];
  assign addr85 = addr[85];
  assign addr86 = addr[86];
  assign addr87 = addr[87];
  assign addr88 = addr[88];
  assign addr89 = addr[89];
  assign addr90 = addr[90];
  assign addr91 = addr[91];
  assign addr92 = addr[92];
  assign addr93 = addr[93];
  assign addr94 = addr[94];
  assign addr95 = addr[95];
  assign addr96 = addr[96];
  assign addr97 = addr[97];
  assign addr98 = addr[98];
  assign addr99 = addr[99];
  assign addr100 = addr[100];
  assign addr101 = addr[101];
  assign addr102 = addr[102];
  assign addr103 = addr[103];
  assign addr104 = addr[104];
  assign addr105 = addr[105];
  assign addr106 = addr[106];
  assign addr107 = addr[107];
  assign addr108 = addr[108];
  assign addr109 = addr[109];
  assign addr110 = addr[110];
  assign addr111 = addr[111];
  assign addr112 = addr[112];
  assign addr113 = addr[113];
  assign addr114 = addr[114];
  assign addr115 = addr[115];
  assign addr116 = addr[116];
  assign addr117 = addr[117];
  assign addr118 = addr[118];
  assign addr119 = addr[119];
  assign addr120 = addr[120];
  assign addr121 = addr[121];
  assign addr122 = addr[122];
  assign addr123 = addr[123];
  assign addr124 = addr[124];
  assign addr125 = addr[125];
  assign addr126 = addr[126];
  assign addr127 = addr[127];
  assign addr128 = addr[128];
  assign addr129 = addr[129];
  assign addr130 = addr[130];
  assign addr131 = addr[131];
  assign addr132 = addr[132];
  assign addr133 = addr[133];
  assign addr134 = addr[134];
  assign addr135 = addr[135];
  assign addr136 = addr[136];
  assign addr137 = addr[137];
  assign addr138 = addr[138];
  assign addr139 = addr[139];
  assign addr140 = addr[140];
  assign addr141 = addr[141];
  assign addr142 = addr[142];
  assign addr143 = addr[143];
  assign addr144 = addr[144];
  assign addr145 = addr[145];
  assign addr146 = addr[146];
  assign addr147 = addr[147];
  assign addr148 = addr[148];
  assign addr149 = addr[149];
  assign addr150 = addr[150];
  assign addr151 = addr[151];
  assign addr152 = addr[152];
  assign addr153 = addr[153];
  assign addr154 = addr[154];
  assign addr155 = addr[155];
  assign addr156 = addr[156];
  assign addr157 = addr[157];
  assign addr158 = addr[158];
  assign addr159 = addr[159];
  assign addr160 = addr[160];
  assign addr161 = addr[161];
  assign addr162 = addr[162];
  assign addr163 = addr[163];
  assign addr164 = addr[164];
  assign addr165 = addr[165];
  assign addr166 = addr[166];
  assign addr167 = addr[167];
  assign addr168 = addr[168];
  assign addr169 = addr[169];
  assign addr170 = addr[170];
  assign addr171 = addr[171];
  assign addr172 = addr[172];
  assign addr173 = addr[173];
  assign addr174 = addr[174];
  assign addr175 = addr[175];
  assign addr176 = addr[176];
  assign addr177 = addr[177];
  assign addr178 = addr[178];
  assign addr179 = addr[179];
  assign addr180 = addr[180];
  assign addr181 = addr[181];
  assign addr182 = addr[182];
  assign addr183 = addr[183];
  assign addr184 = addr[184];
  assign addr185 = addr[185];
  assign addr186 = addr[186];
  assign addr187 = addr[187];
  assign addr188 = addr[188];
  assign addr189 = addr[189];
  assign addr190 = addr[190];
  assign addr191 = addr[191];
  assign addr192 = addr[192];
  assign addr193 = addr[193];
  assign addr194 = addr[194];
  assign addr195 = addr[195];
  assign addr196 = addr[196];
  assign addr197 = addr[197];
  assign addr198 = addr[198];
  assign addr199 = addr[199];
  assign addr200 = addr[200];
  assign addr201 = addr[201];
  assign addr202 = addr[202];
  assign addr203 = addr[203];
  assign addr204 = addr[204];
  assign addr205 = addr[205];
  assign addr206 = addr[206];
  assign addr207 = addr[207];
  assign addr208 = addr[208];
  assign addr209 = addr[209];
  assign addr210 = addr[210];
  assign addr211 = addr[211];
  assign addr212 = addr[212];
  assign addr213 = addr[213];
  assign addr214 = addr[214];
  assign addr215 = addr[215];
  assign addr216 = addr[216];
  assign addr217 = addr[217];
  assign addr218 = addr[218];
  assign addr219 = addr[219];
  assign addr220 = addr[220];
  assign addr221 = addr[221];
  assign addr222 = addr[222];
  assign addr223 = addr[223];
  assign addr224 = addr[224];
  assign addr225 = addr[225];
  assign addr226 = addr[226];
  assign addr227 = addr[227];
  assign addr228 = addr[228];
  assign addr229 = addr[229];
  assign addr230 = addr[230];
  assign addr231 = addr[231];
  assign addr232 = addr[232];
  assign addr233 = addr[233];
  assign addr234 = addr[234];
  assign addr235 = addr[235];
  assign addr236 = addr[236];
  assign addr237 = addr[237];
  assign addr238 = addr[238];
  assign addr239 = addr[239];
  assign addr240 = addr[240];
  assign addr241 = addr[241];
  assign addr242 = addr[242];
  assign addr243 = addr[243];
  assign addr244 = addr[244];
  assign addr245 = addr[245];
  assign addr246 = addr[246];
  assign addr247 = addr[247];
  assign addr248 = addr[248];
  assign addr249 = addr[249];
  assign addr250 = addr[250];
  assign addr251 = addr[251];
  assign addr252 = addr[252];
  assign addr253 = addr[253];
  assign addr254 = addr[254];
  assign addr255 = addr[255];
endmodule
